# EAGLE design Servo-potenciom-3 (EAGLE 7.2.0)
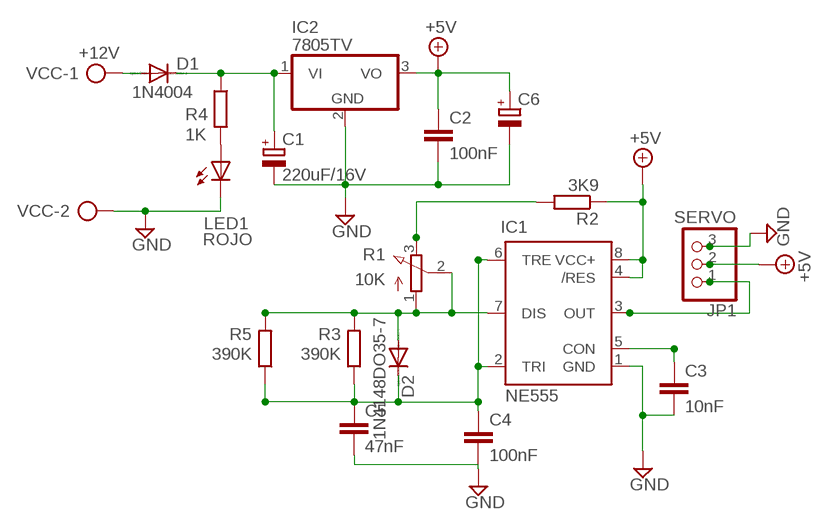
[diagram p0: schematic, sheet 1]

## Parts
C1  220uF/16V  CPOL-EUE2.5-7  [E2,5-7]
C2  100nF  C-EU050-025X075  [C050-025X075]
C3  10nF  C-EU050-025X075  [C050-025X075]
C4  100nF  C-EU050-025X075  [C050-025X075]
C5  47nF  C-EU050-025X075  [C050-025X075]
C6  CPOL-EUE2.5-5  [E2,5-5]
D1  1N4004  [DO41-10]
D2  1N4148DO35-7  [DO35-7]
IC1  NE555  [DIL-08]
IC2  7805TV  [TO220V]
JP1  SERVO  PINHD-1X3  [1X03]
LED1  ROJO  LED3MM  [LED3MM]
R1  10K  3RP/1610N  [3RP/1610N]
R2  3K9  R-EU_0207/10  [0207/10]
R3  390K  R-EU_0207/10  [0207/10]
R4  1K  R-EU_0207/10  [0207/10]
R5  390K  R-EU_0207/10  [0207/10]
VCC  +12V  AK500/2-H  [AK500/2-H]

## Nets
+5V: C2.1 C6.+ IC1.4(/RES) IC1.8(VCC+) IC2.3(VO) JP1.2 R2.1
GND: C1.- C2.2 C3.2 C4.2 C5.2 C6.- IC1.1(GND) IC2.2(GND) JP1.3 LED1.K(C) VCC.2
N$1: D1.A VCC.1
N$2: C1.+ D1.C IC2.1(VI) R4.1
N$3: IC1.3(OUT) JP1.1
N$4: C3.1 IC1.5(CON)
N$5: R1.3(E) R2.2
N$6: D2.A IC1.7(DIS) R1.1(A) R1.2(S) R3.2 R5.2
N$7: C4.1 C5.1 D2.C IC1.2(TRI) IC1.6(TRE) R3.1 R5.1
N$8: LED1.A R4.2

## Library data of the parts
C1 C6 = rcl:CPOL-EU: POLARIZED CAPACITOR, European symbol
C2-C5 = rcl:C-EU: CAPACITOR, European symbol
D1 = diode:1N4004: DIODE general purpose rectifier, 1 A
D2 = diode:1N4148: DIODE high speed (Philips)
IC1 = st-microelectronics:NE555: General purpose bipolar Timer; MF: Arrow Electronics; MPN: NE555N; OC_FARNELL: 1467742; OC_NEWARK: 89K1486
IC2 = linear:78*: Positive VOLTAGE REGULATOR Source: http://cache.national.com/ds/LM/LM78L05.pdf http://www.fairchildsemi.com/ds/LM/LM7805.pdf
JP1 = pinhead:PINHD-1X3: PIN HEADER
LED1 = led:LED: LED OSRAM: - CHIPLED LG R971, LG N971, LY N971, LG Q971, LY Q971, LO R971, LY R971 LH N974, LH R974 LS Q976, LO Q976, LY Q976 LO Q996 - Hyper CHIPLED LW Q18S LB Q993, LB Q99A, LB R99A - SideLED LS A670, LO A670, LY A670, LG A670, LP A670 LB A673, LV A673, LT A673, LW A673 LH A674 LY A675 LS A676, LA A676, LO A676, LY A676, LW A676 LS A679, LY A679, LG A679 - Hyper Micro SIDELED® LS Y876, LA Y876, LO Y876, LY Y876 LT Y87S - SmartLED LW L88C, LW L88S LB L89C, LB L89S, LG L890 LS L89K, LO L89K, LY L89K LS L896, LA L896, LO L896, LY L896 - TOPLED LS T670, LO T670, LY T670, LG T670, LP T670 LSG T670, LSP T670, LSY T670, LOP T670, LYG T670 LG T671, LOG T671, LSG T671 LB T673, LV T673, LT T673, LW T673 LH T674 LS T676, LA T676, LO T676, LY T676, LB T676, LH T676, LSB T676, LW T676 LB T67C, LV T67C, LT T67C, LS T67K, LO T67K, LY T67K, LW E67C LS E67B, LA E67B, LO E67B, LY E67B, LB E67C, LV E67C, LT E67C LW T67C LS T679, LY T679, LG T679 LS T770, LO T770, LY T770, LG T770, LP T770 LB T773, LV T773, LT T773, LW T773 LH T774 LS E675, LA E675, LY E675, LS T675 LS T776, LA T776, LO T776, LY T776, LB T776 LHGB T686 LT T68C, LB T68C - Hyper Mini TOPLED® LB M676 - Mini TOPLED Santana® LG M470 LS M47K, LO M47K, LY M47K Source: http://www.osram.convergy.de LUXEON: - LUMILED® LXK2-PW12-R00, LXK2-PW12-S00, LXK2-PW14-U00, LXK2-PW14-V00 LXK2-PM12-R00, LXK2-PM12-S00, LXK2-PM14-U00 LXK2-PE12-Q00, LXK2-PE12-R00, LXK2-PE12-S00, LXK2-PE14-T00, LXK2-PE14-U00 LXK2-PB12-K00, LXK2-PB12-L00, LXK2-PB12-M00, LXK2-PB14-N00, LXK2-PB14-P00, LXK2-PB14-Q00 LXK2-PR12-L00, LXK2-PR12-M00, LXK2-PR14-Q00, LXK2-PR14-R00 LXK2-PD12-Q00, LXK2-PD12-R00, LXK2-PD12-S00 LXK2-PH12-R00, LXK2-PH12-S00 LXK2-PL12-P00, LXK2-PL12-Q00, LXK2-PL12-R00 Source: www.luxeon.com KINGBRIGHT: KA-3528ASYC Source: www.kingbright.com
R1 = pot:3RP/1610N: 16mm Potentiometer one level Source: http://www.alphapotentiometers.net/html/16mm_pot_2.html
R2-R5 = rcl:R-EU_: RESISTOR, European symbol
VCC = con-ptr500:AK500/2-H: CONNECTOR Aug. 2004 / PTR Meßtechnik: Die Bezeichnung der Serie AK505 wurde geändert. Es handelt sich hierbei um AK500 in horizontaler Ausführung.; OC_FARNELL: unknown; OC_NEWARK: unknown

## Board
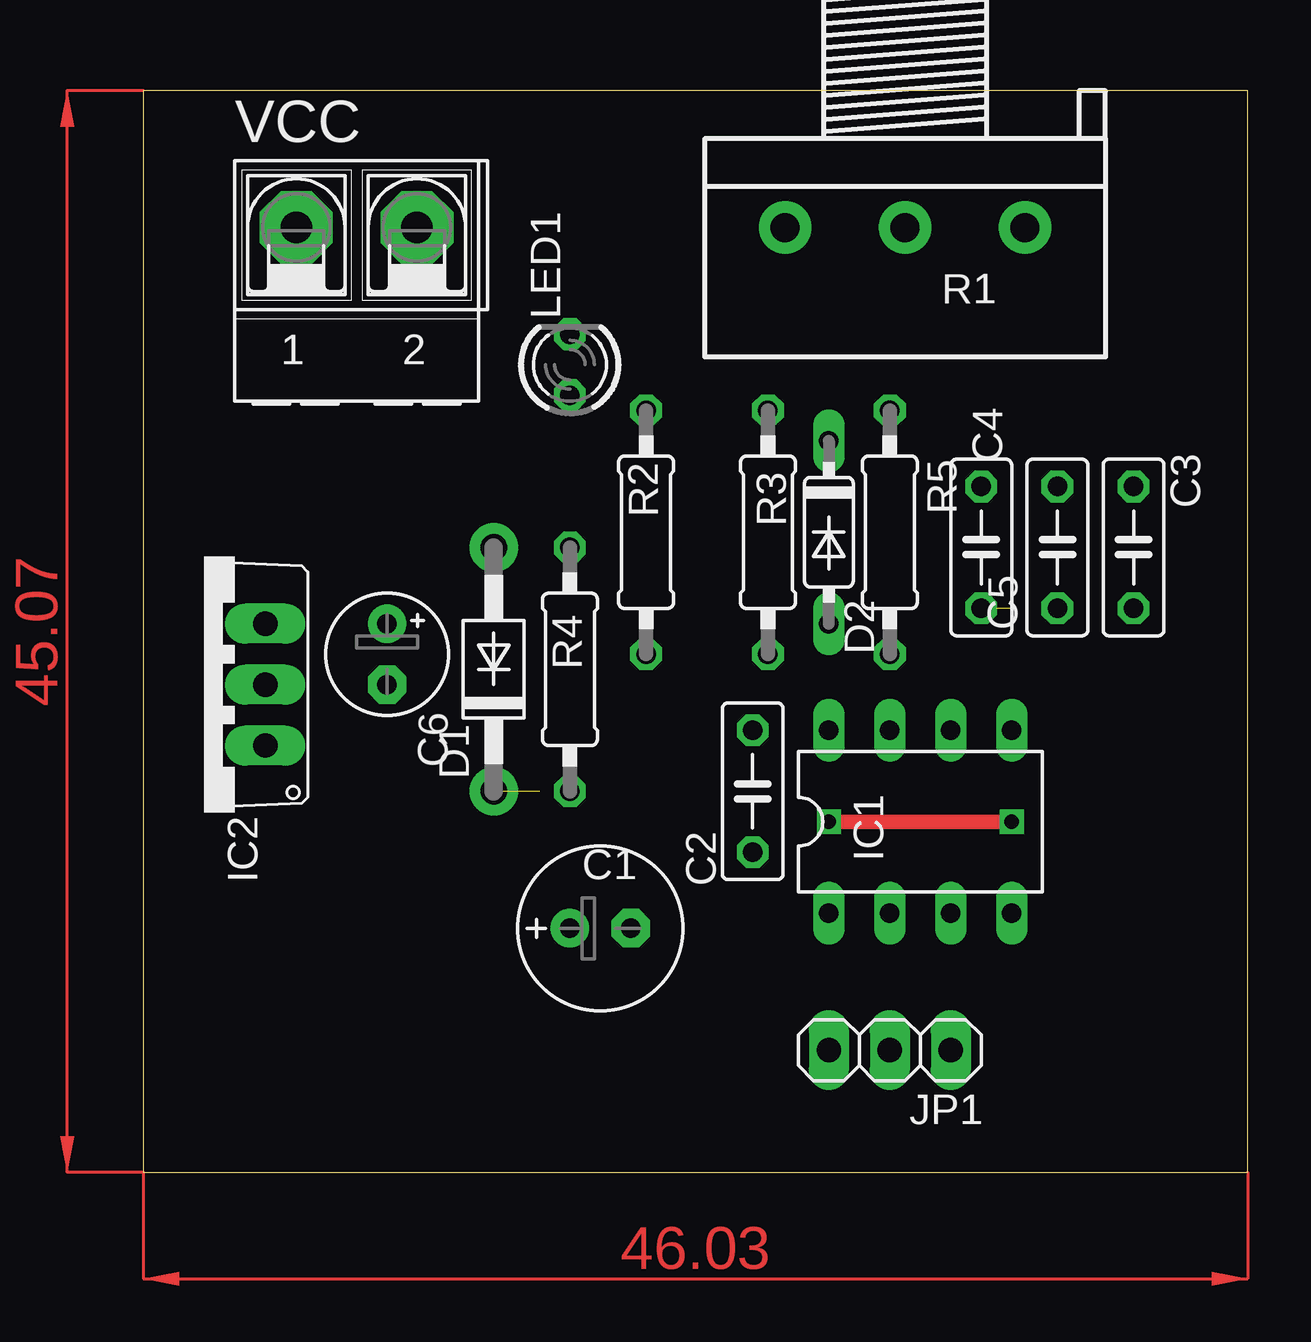
[diagram p1: board, top side]
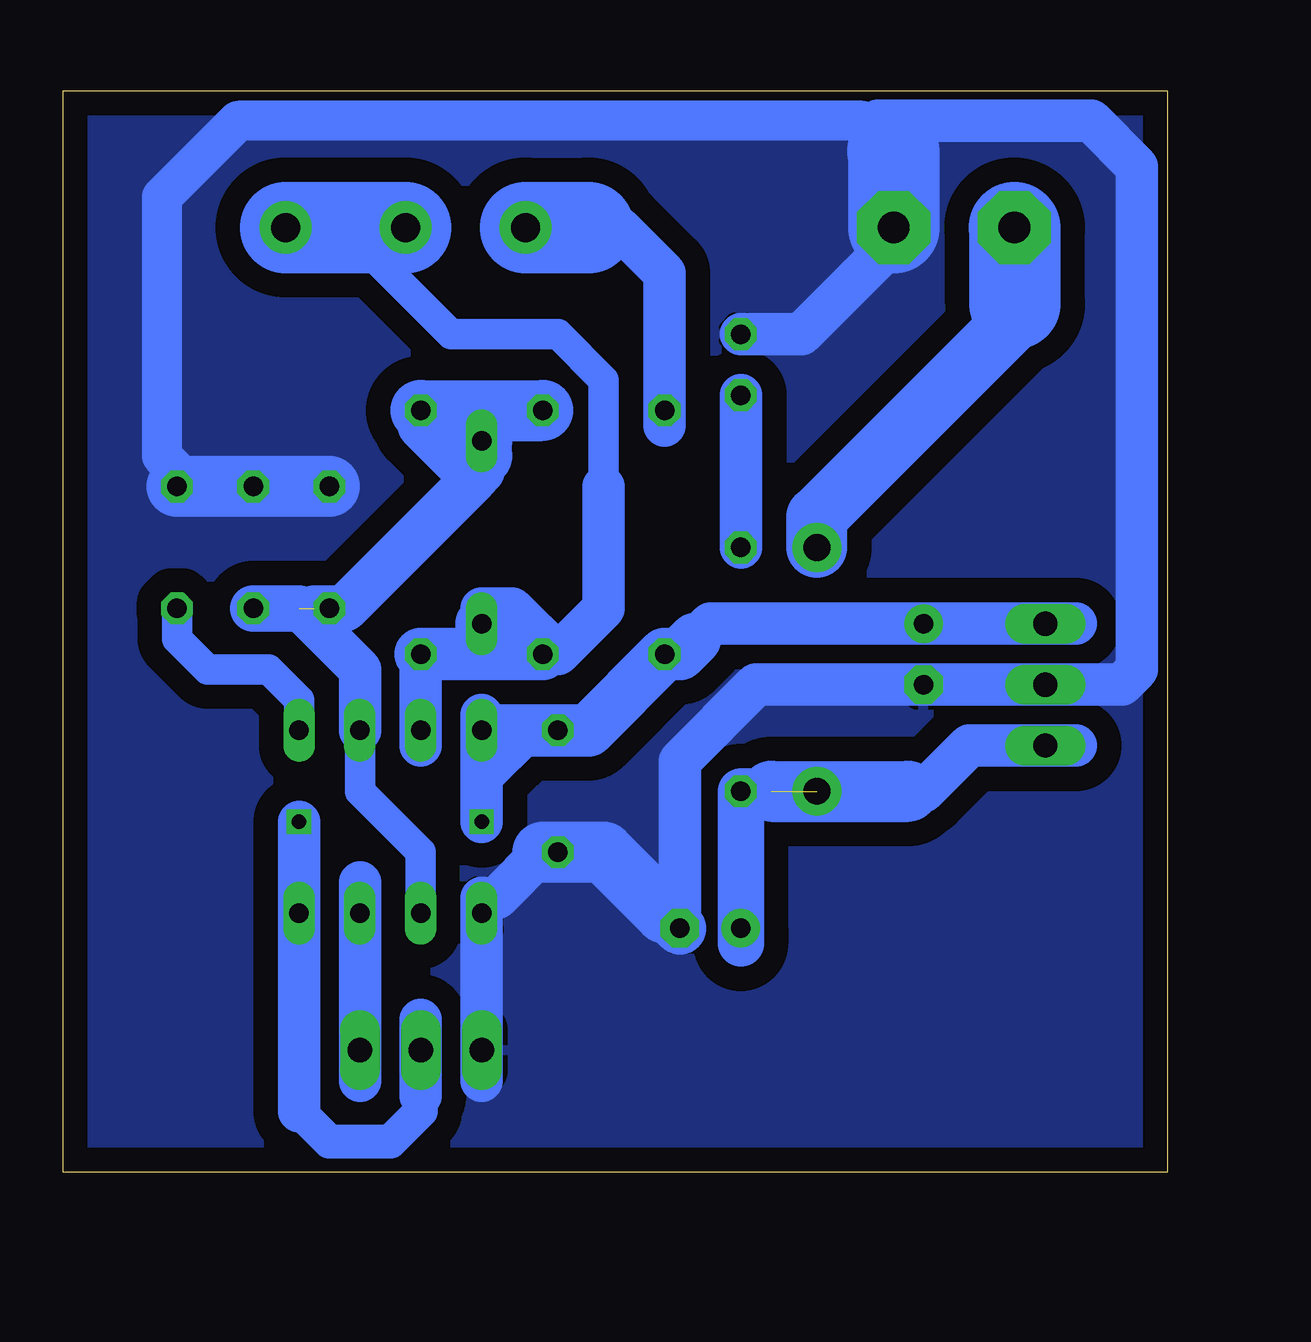
[diagram p2: board, bottom side, seen from below]

Size 46.03 x 45.07 mm. Coordinates in mm from the lower left corner, seen from the top.
Outline: 0,0 46.03,0 46.03,45.07 0,45.07 0,0
Copper layers (1*16): Top 0.035mm / dielectric 1.5mm / Bottom 0.035mm
Design rules "default": minimum track width 10mil, minimum drill 24mil, track to track 8mil, track to pad 8mil, pad to pad 8mil, via to via 8mil, smd to smd 8mil, copper to edge 40mil, drill to drill 8mil, minimum pad ring 10mil, minimum via ring 8mil, stop-mask expansion 4mil, vias tented up to drill 0mil, thermal gap 10mil

### Footprints (pad centres in the part's own frame; a part is rotated, then mirrored left to right if it is on the bottom)
E2,5-7 = drill 0.813 pad 1.6: + -1.27,0 | drill 0.813 pad 1.6 octagon: - 1.27,0
C050-025X075 = drill 0.813 octagon: 1 -2.54,0; 2 2.54,0
E2,5-5 = drill 0.813 pad 1.6: + -1.27,0 | drill 0.813 pad 1.6 octagon: - 1.27,0
DO41-10 = drill 1.118 pad 2.032: A 5.08,0; C -5.08,0
DO35-7 = drill 0.813 long: A 3.81,0; C -3.81,0
DIL-08 = drill 0.813 long: 1 -3.81,-3.81; 2 -1.27,-3.81; 3 1.27,-3.81; 4 3.81,-3.81; 5 3.81,3.81; 6 1.27,3.81; 7 -1.27,3.81; 8 -3.81,3.81
TO220V = drill 1.016 pad 1.676 long: 1 -2.54,-2.54; 2 0,-2.54; 3 2.54,-2.54
1X03 = drill 1.016 pad 1.676 long: 1 -2.54,0; 2 0,0; 3 2.54,0
LED3MM = drill 0.813 octagon: A -1.27,0; K 1.27,0
3RP/1610N = drill 1.2 pad 2.184: 1 -5,0; 2 0,0; 3 5,0
0207/10 = drill 0.813 octagon: 1 -5.08,0; 2 5.08,0
AK500/2-H = drill 1.321 pad 3.048 octagon: 1 -2.515,0; 2 2.515,0

### Placement (x,y rotation side)
C1  19.05,10.16 0 top
C2  25.4,15.87 270 top
C3  41.27,26.03 90 top
C4  34.93,26.03 90 top
C5  38.1,26.03 90 top
C6  10.16,21.59 270 top
D1  14.61,20.95 90 top
D2  28.58,26.67 270 top
IC1  32.39,14.6 0 top
IC2  2.54,20.32 90 top
JP1  31.12,5.08 180 top
LED1  17.78,33.66 90 top
R1  31.75,39.37 180 top
R2  20.95,26.67 90 top
R3  26.04,26.67 270 top
R4  17.78,20.95 90 top
R5  31.12,26.67 270 top
VCC  8.89,39.37 0 top

### Tracks (layer width: path | path; a pad name or v marks a point on that pad's centre or on a via)
+5V  (via drill 0.6)
  Top 0.61: v28.58,14.6 v36.2,14.6
  Bottom 1.422: 31.12,3.17 31.12,2.54 32.39,1.27 34.93,1.27 36.2,2.54
  Bottom 1.778: IC1.8 28.58,19.05 | IC1.8 28.58,16.51 | 28.58,16.51 v28.58,14.6 | v36.2,14.6 IC1.4 36.2,2.54 | 3.81,22.86 IC2.3 C6.+ 19.05,22.86 19.69,22.23 | 27.94,18.41 IC1.8 | C2.1 26.67,18.41 28.58,16.51 | 31.12,6.35 JP1.2 31.12,3.17
  Bottom 2.184: 19.69,22.23 20.32,21.59 R2.1 24.13,18.41 C2.1 27.94,18.41
GND
  Bottom 1.676: 11.43,42.54 12.38,43.5 12.7,43.81 38.73,43.81 41.91,40.64 41.91,29.84 40.64,28.57
  Bottom 1.778: LED1.K 15.24,34.92 11.43,38.73 11.43,39.34 VCC.2 | IC2.2 C6.- | C6.- 17.15,20.32 20.32,17.14 C1.- | C6.- 1.91,20.32 1.27,20.95 1.27,41.91 3.18,43.81 12.07,43.81 12.38,43.5 | 28.58,3.81 JP1.3 IC1.1 28.58,11.43 27.94,11.43 26.04,13.33
  Bottom 2.184: 20.95,10.79 C1.-
  Bottom 2.54: C4.2 C5.2 40.64,28.57 C3.2 | 26.04,13.33 23.5,13.33 20.95,10.79
  Bottom 3.81: VCC.2 11.41,42.52 11.43,42.54
  pour Bottom (isolate 1.016): 0,0 46.36,0 46.36,45.09 0,45.09
N$1
  Bottom 2.54: D1.A 14.61,27.3 6.35,35.56 6.35,36.2
  Bottom 3.81: 6.35,36.2 6.35,39.34 VCC.1
N$2  (1 unrouted)
  Bottom 1.778: 10.8,15.87 10.16,15.87 8.26,17.78 IC2.1 3.81,17.78
  Bottom 1.93: 17.78,9.53 C1.+ R4.1 16.51,15.87
  Bottom 2.54: 16.51,15.87 10.8,15.87
N$3
  Bottom 1.778: 33.66,3.81 JP1.1 IC1.3 33.66,12.06
N$4
  Bottom 1.27: IC1.5 36.2,19.68 37.47,20.95 40.01,20.95 41.27,22.23 C3.1
N$5
  Bottom 1.778: 24.13,39.37 22.86,39.37 20.95,37.46 R2.2 20.95,31.11
  Bottom 3.81: R1.3 24.13,39.37
N$6
  Bottom 1.27: 23.5,28.57 23.5,33.02 25.4,34.92 29.84,34.92 34.29,39.37
  Bottom 1.778: 31.12,17.78 IC1.7 R5.2 | D2.A 28.58,23.49 27.3,23.49 25.4,21.59 23.5,23.49 23.5,28.57
  Bottom 2.184: R3.2 28.58,21.59 | 28.58,21.59 R5.2 | D2.A 28.58,21.59
  Bottom 3.81: R1.1 35.56,39.37 34.29,39.37 R1.2
N$7  (1 unrouted)
  Bottom 1.27: IC1.2 31.12,13.33 33.66,15.87 IC1.6
  Bottom 1.778: IC1.6 33.66,20.95 36.2,23.49
  Bottom 1.93: 36.2,23.49 C5.1 | 35.56,23.49 C4.1 34.29,23.49 28.89,28.89 | 28.89,28.89 28.58,29.21 28.58,29.84 | R5.1 31.12,31.11 28.89,28.89
  Bottom 2.54: R5.1 R3.1 | 28.58,29.84 D2.C
N$8
  Bottom 1.778: R4.2 LED1.A
(copper drawn outside any net)
  shapes: Top area x2